# Altium schematic sheet LPDDR4_32bits.SchDoc
size A3; SheetNumber: 5; SheetTotal: 5
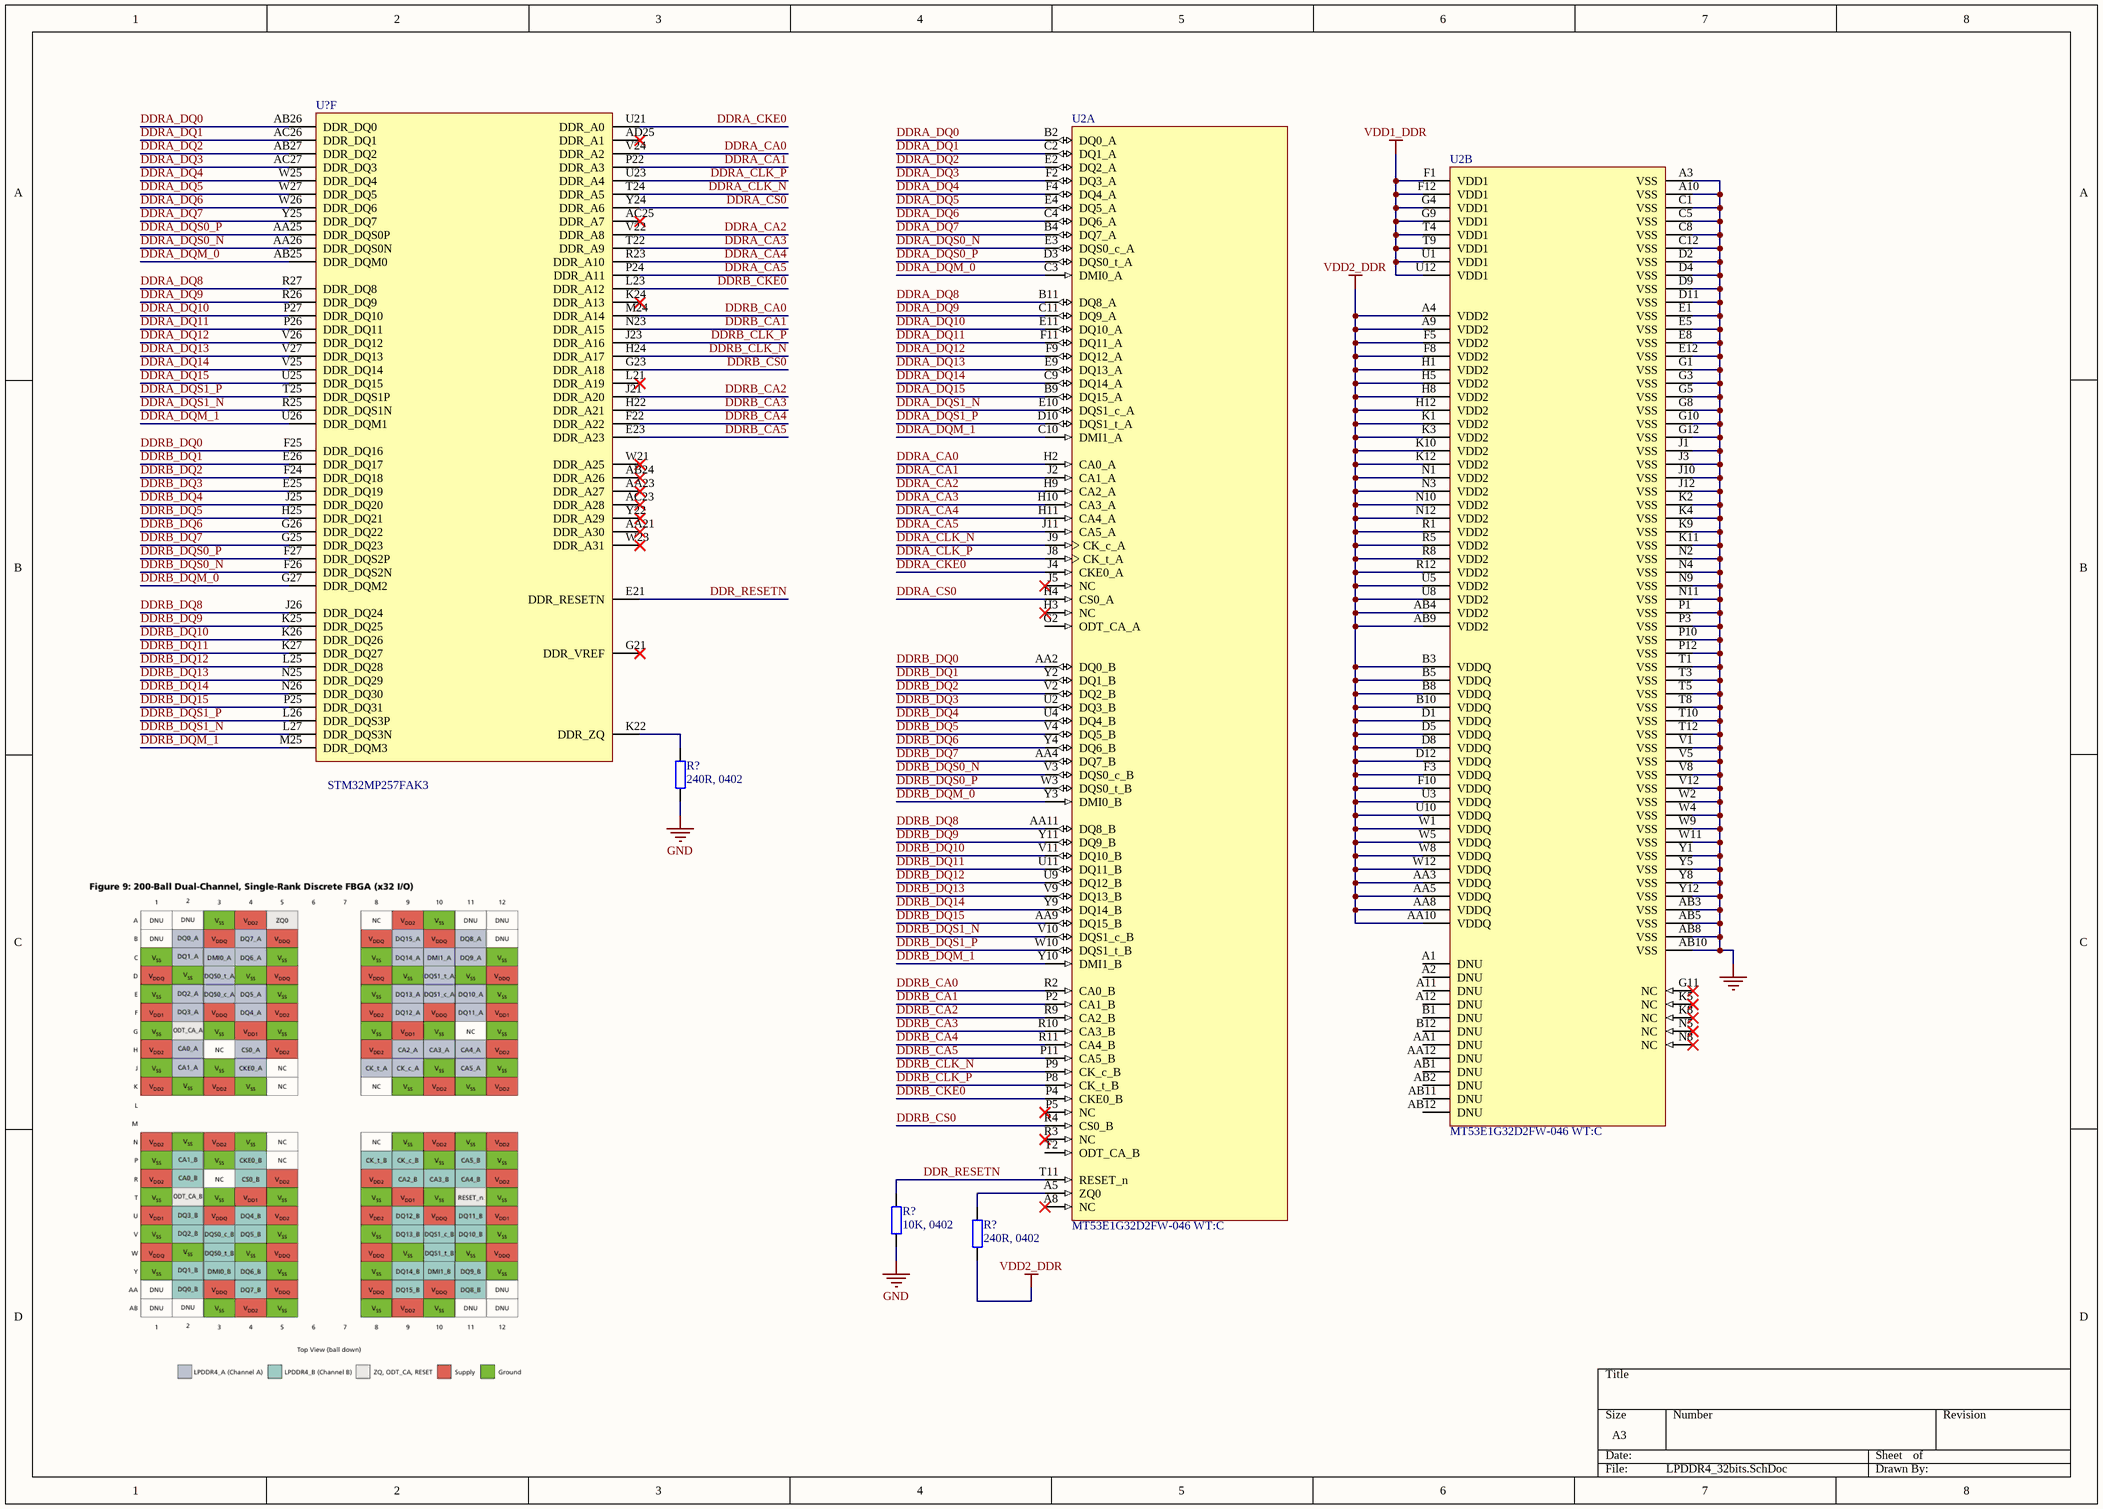
[diagram p0: LPDDR4_32bits.SchDoc]

## Parts
(Parts that share a designator on the sheet are numbered #1, #2 ... from top to bottom, then left to right.)
R?#1  240R, 0402  [RES_0402]
R?#2  10K, 0402  [RES_0402]
R?#3  240R, 0402  [RES_0402]
U2  MT53E1G32D2FW-046 WT:C  [ICC_TFBGA200_10X14P5_P080_H1P05_PS0P3]  (parts A,B of 2)
U?  STM32MP257FAK3  [ICC_TFBGA424_14X14_P050_H1P20_CODE-B0A2]  (part F of 9)

## Nets
GND: R?#1.1 R?#2.1 U2.A3(VSS) U2.A10(VSS) U2.AB3(VSS) U2.AB5(VSS) U2.AB8(VSS) U2.AB10(VSS) U2.C1(VSS) U2.C5(VSS) U2.C8(VSS) U2.C12(VSS) U2.D2(VSS) U2.D4(VSS) U2.D9(VSS) U2.D11(VSS) U2.E1(VSS) U2.E5(VSS) U2.E8(VSS) U2.E12(VSS) U2.G1(VSS) U2.G3(VSS) U2.G5(VSS) U2.G8(VSS) U2.G10(VSS) U2.G12(VSS) U2.J1(VSS) U2.J3(VSS) U2.J10(VSS) U2.J12(VSS) U2.K2(VSS) U2.K4(VSS) U2.K9(VSS) U2.K11(VSS) U2.N2(VSS) U2.N4(VSS) U2.N9(VSS) U2.N11(VSS) U2.P1(VSS) U2.P3(VSS) U2.P10(VSS) U2.P12(VSS) U2.T1(VSS) U2.T3(VSS) U2.T5(VSS) U2.T8(VSS) U2.T10(VSS) U2.T12(VSS) U2.V1(VSS) U2.V5(VSS) U2.V8(VSS) U2.V12(VSS) U2.W2(VSS) U2.W4(VSS) U2.W9(VSS) U2.W11(VSS) U2.Y1(VSS) U2.Y5(VSS) U2.Y8(VSS) U2.Y12(VSS)
VDD1_DDR: U2.F1(VDD1) U2.F12(VDD1) U2.G4(VDD1) U2.G9(VDD1) U2.T4(VDD1) U2.T9(VDD1) U2.U1(VDD1) U2.U12(VDD1)
VDD2_DDR: R?#3.1 U2.A4(VDD2) U2.A9(VDD2) U2.AA3(VDDQ) U2.AA5(VDDQ) U2.AA8(VDDQ) U2.AA10(VDDQ) U2.AB4(VDD2) U2.AB9(VDD2) U2.B3(VDDQ) U2.B5(VDDQ) U2.B8(VDDQ) U2.B10(VDDQ) U2.D1(VDDQ) U2.D5(VDDQ) U2.D8(VDDQ) U2.D12(VDDQ) U2.F3(VDDQ) U2.F5(VDD2) U2.F8(VDD2) U2.F10(VDDQ) U2.H1(VDD2) U2.H5(VDD2) U2.H8(VDD2) U2.H12(VDD2) U2.K1(VDD2) U2.K3(VDD2) U2.K10(VDD2) U2.K12(VDD2) U2.N1(VDD2) U2.N3(VDD2) U2.N10(VDD2) U2.N12(VDD2) U2.R1(VDD2) U2.R5(VDD2) U2.R8(VDD2) U2.R12(VDD2) U2.U3(VDDQ) U2.U5(VDD2) U2.U8(VDD2) U2.U10(VDDQ) U2.W1(VDDQ) U2.W5(VDDQ) U2.W8(VDDQ) U2.W12(VDDQ)
DDR_RESETN: R?#2.2 U2.T11(RESET_n) U?.E21(DDR_RESETN)
DDRA_CA0: U2.H2(CA0_A) U?.V24(DDR_A2)
DDRA_CA1: U2.J2(CA1_A) U?.P22(DDR_A3)
DDRA_CA2: U2.H9(CA2_A) U?.V22(DDR_A8)
DDRA_CA3: U2.H10(CA3_A) U?.T22(DDR_A9)
DDRA_CA4: U2.H11(CA4_A) U?.R23(DDR_A10)
DDRA_CA5: U2.J11(CA5_A) U?.P24(DDR_A11)
DDRA_CKE0: U2.J4(CKE0_A) U?.U21(DDR_A0)
DDRA_CLK_N: U2.J9(CK_c_A) U?.T24(DDR_A5)
DDRA_CLK_P: U2.J8(CK_t_A) U?.U23(DDR_A4)
DDRA_CS0: U2.H4(CS0_A) U?.Y24(DDR_A6)
DDRA_DQ0: U2.B2(DQ0_A) U?.AB26(DDR_DQ0)
DDRA_DQ1: U2.C2(DQ1_A) U?.AC26(DDR_DQ1)
DDRA_DQ2: U2.E2(DQ2_A) U?.AB27(DDR_DQ2)
DDRA_DQ3: U2.F2(DQ3_A) U?.AC27(DDR_DQ3)
DDRA_DQ4: U2.F4(DQ4_A) U?.W25(DDR_DQ4)
DDRA_DQ5: U2.E4(DQ5_A) U?.W27(DDR_DQ5)
DDRA_DQ6: U2.C4(DQ6_A) U?.W26(DDR_DQ6)
DDRA_DQ7: U2.B4(DQ7_A) U?.Y25(DDR_DQ7)
DDRA_DQ8: U2.B11(DQ8_A) U?.R27(DDR_DQ8)
DDRA_DQ9: U2.C11(DQ9_A) U?.R26(DDR_DQ9)
DDRA_DQ10: U2.E11(DQ10_A) U?.P27(DDR_DQ10)
DDRA_DQ11: U2.F11(DQ11_A) U?.P26(DDR_DQ11)
DDRA_DQ12: U2.F9(DQ12_A) U?.V26(DDR_DQ12)
DDRA_DQ13: U2.E9(DQ13_A) U?.V27(DDR_DQ13)
DDRA_DQ14: U2.C9(DQ14_A) U?.V25(DDR_DQ14)
DDRA_DQ15: U2.B9(DQ15_A) U?.U25(DDR_DQ15)
DDRA_DQM_0: U2.C3(DMI0_A) U?.AB25(DDR_DQM0)
DDRA_DQM_1: U2.C10(DMI1_A) U?.U26(DDR_DQM1)
DDRA_DQS0_N: U2.E3(DQS0_c_A) U?.AA26(DDR_DQS0N)
DDRA_DQS0_P: U2.D3(DQS0_t_A) U?.AA25(DDR_DQS0P)
DDRA_DQS1_N: U2.E10(DQS1_c_A) U?.R25(DDR_DQS1N)
DDRA_DQS1_P: U2.D10(DQS1_t_A) U?.T25(DDR_DQS1P)
DDRB_CA0: U2.R2(CA0_B) U?.M24(DDR_A14)
DDRB_CA1: U2.P2(CA1_B) U?.N23(DDR_A15)
DDRB_CA2: U2.R9(CA2_B) U?.J21(DDR_A20)
DDRB_CA3: U2.R10(CA3_B) U?.H22(DDR_A21)
DDRB_CA4: U2.R11(CA4_B) U?.F22(DDR_A22)
DDRB_CA5: U2.P11(CA5_B) U?.E23(DDR_A23)
DDRB_CKE0: U2.P4(CKE0_B) U?.L23(DDR_A12)
DDRB_CLK_N: U2.P9(CK_c_B) U?.H24(DDR_A17)
DDRB_CLK_P: U2.P8(CK_t_B) U?.J23(DDR_A16)
DDRB_CS0: U2.R4(CS0_B) U?.G23(DDR_A18)
DDRB_DQ0: U2.AA2(DQ0_B) U?.F25(DDR_DQ16)
DDRB_DQ1: U2.Y2(DQ1_B) U?.E26(DDR_DQ17)
DDRB_DQ2: U2.V2(DQ2_B) U?.F24(DDR_DQ18)
DDRB_DQ3: U2.U2(DQ3_B) U?.E25(DDR_DQ19)
DDRB_DQ4: U2.U4(DQ4_B) U?.J25(DDR_DQ20)
DDRB_DQ5: U2.V4(DQ5_B) U?.H25(DDR_DQ21)
DDRB_DQ6: U2.Y4(DQ6_B) U?.G26(DDR_DQ22)
DDRB_DQ7: U2.AA4(DQ7_B) U?.G25(DDR_DQ23)
DDRB_DQ8: U2.AA11(DQ8_B) U?.J26(DDR_DQ24)
DDRB_DQ9: U2.Y11(DQ9_B) U?.K25(DDR_DQ25)
DDRB_DQ10: U2.V11(DQ10_B) U?.K26(DDR_DQ26)
DDRB_DQ11: U2.U11(DQ11_B) U?.K27(DDR_DQ27)
DDRB_DQ12: U2.U9(DQ12_B) U?.L25(DDR_DQ28)
DDRB_DQ13: U2.V9(DQ13_B) U?.N25(DDR_DQ29)
DDRB_DQ14: U2.Y9(DQ14_B) U?.N26(DDR_DQ30)
DDRB_DQ15: U2.AA9(DQ15_B) U?.P25(DDR_DQ31)
DDRB_DQM_0: U2.Y3(DMI0_B) U?.G27(DDR_DQM2)
DDRB_DQM_1: U2.Y10(DMI1_B) U?.M25(DDR_DQM3)
DDRB_DQS0_N: U2.V3(DQS0_c_B) U?.F26(DDR_DQS2N)
DDRB_DQS0_P: U2.W3(DQS0_t_B) U?.F27(DDR_DQS2P)
DDRB_DQS1_N: U2.V10(DQS1_c_B) U?.L27(DDR_DQS3N)
DDRB_DQS1_P: U2.W10(DQS1_t_B) U?.L26(DDR_DQS3P)
NetR?#1_2: R?#1.2 U?.K22(DDR_ZQ)
NetR?#3_2: R?#3.2 U2.A5(ZQ0)

Not connected (* = marked no-connect by the designer): U2 A1(DNU) A2(DNU) A8(NC)* A11(DNU) A12(DNU) AA1(DNU) AA12(DNU) AB1(DNU) AB2(DNU) AB11(DNU) AB12(DNU) B1(DNU) B12(DNU) G2(ODT_CA_A) G11(NC)* H3(NC)* J5(NC)* K5(NC)* K8(NC)* N5(NC)* N8(NC)* P5(NC)* R3(NC)* T2(ODT_CA_B); U? AA21(DDR_A30)* AA23(DDR_A27)* AB24(DDR_A26)* AC23(DDR_A28)* AC25(DDR_A7)* AD25(DDR_A1)* G21(DDR_VREF)* K24(DDR_A13)* L21(DDR_A19)* W21(DDR_A25)* W23(DDR_A31)* Y22(DDR_A29)*

## Library data of the parts
R?#1-R?#3 = RES_0402: Resistor SMD 0402; Manufacturer: *; Manufacturer Part Number: *; Distributor Link: *; LCSC: *
U2 = MT53E1G32D2FW-046 WT:C: Memory, LPDDR4 SDRAM,1V8, 32Gbit, 2133MHz; Internal_Part_Number: MCD-04160; Part_Type: IC; Part_Preference: Recommended; Manufacturer: MICRON; ShowFields: YES; ID: 6276; Status: New; Manufacturer_Part_Number: MT53E1G32D2FW-046 WT:C; Package: TFBGA-200; ComponentLink1URL: http://tunmcdsvn.tun.st.com/Component_Documentation_Library/Trunk/IC/MICRON_MT53E1G32D2FW-046-WT-C; Order_Code_Digikey: 557-MT53E1G32D2FW-046WT:C-ND; Order_Code_Farnell: N/A; Order_Code_RS: N/A; Value: MT53E1G32D2FW-046 WT:C
U? = STM32MP257FAK3_1: MPU , 2xCortex-A35@1.5GHz, Cortex-M33@400MHz, TFBGA 14x14, pitch 0.5, 648KB SRAM, With Crypto; Internal_Part_Number: MCD-03375; Part_Type: IC; Part_Preference: Recommended; Manufacturer: STMICROELECTRONICS; Component_Country_Of_Origin: Unknown; ShowFields: YES; ID: 5491; Value: STM32MP257FAK3; Status: Checked; Manufacturer_Part_Number: STM32MP257FAK3; Package: TFBGA; ComponentLink1URL: http://tunmcdsvn.tun.st.com/Component_Documentation_Library/Trunk/IC/STMICROELECTRONICS_STM32MP257FAK3; Order_Code_Digikey: N/A; Order_Code_Farnell: N/A; Order_Code_RS: N/A